# EasyEDA Pro project ProDoc_PCB3_1_.epro

# Board PCB3_1
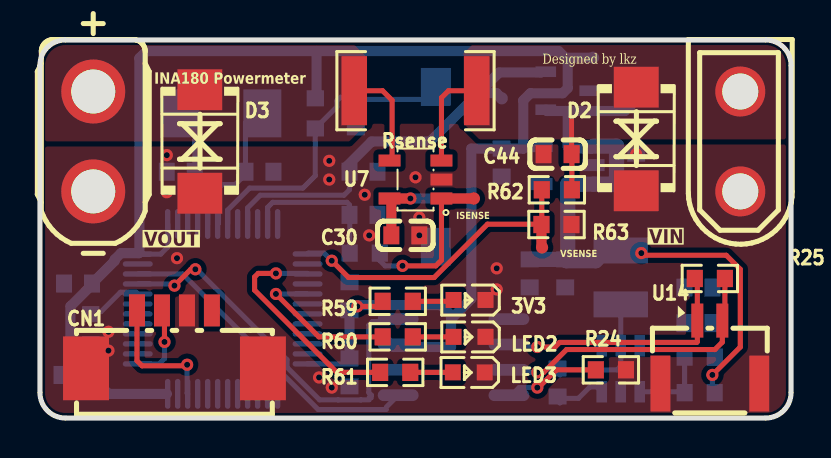
[diagram p0: board, top side]
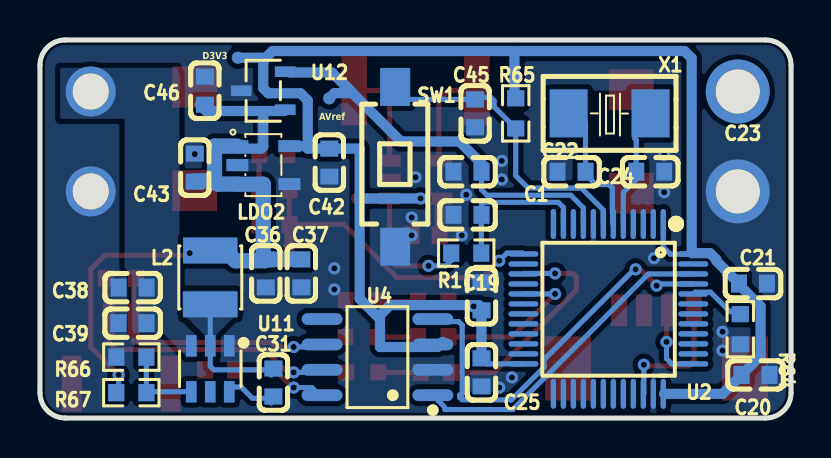
[diagram p1: board, bottom side, seen from below]

Outline 37.59 x 18.92 mm; copper layers: Top Layer, Bottom Layer. Coordinates in mm from the lower left corner of the outline.
Outline path: 0,17.65 0,1.27 arc(0.37,0.37) 1.27,0 36.32,0 arc(37.22,0.37) 37.59,1.27 37.59,17.65 arc(37.22,18.55) 36.32,18.92 1.27,18.92 arc(0.37,18.55) 0,17.65
Stack: Top Layer 0.035mm / Dielectric1 1.51mm FR4 er 4.5 / Bottom Layer 0.035mm

## Design rules (mm)
template: 自定义配置
spacing copperThickness1oz (default): track to track 0.102, other pairs 0.152 to 0.3
spacing copperThickness2oz: track to track 0.203, other pairs 0.152 to 0.3
track width copperThickness1oz (default): min 0.127, default 0.254, max 2.54
track width copperThickness2oz: min 0.203, default 0.254, max 2.54
differential pair differentialPair (default): width min 0.127, default 0.254, max 2.54; gap min 0.152, default 0.152
via viaSize (default): diameter min 0.5, default 0.61, max 10; hole min 0.3, default 0.305, max 6.3
net GND uses copperRegion1
net $3N7199 uses copperRegion1
net +5V uses copperRegion1
net VIN uses copperRegion1
net VOUT uses copperRegion1

## Placement (name value [footprint] x y rotation side)
3V3  KT-0603R  [LED0603-RD]  21.5 5.91 180 top
C1  100nF  [C0603]  16.19 10.17 180 bottom
C19  100nF  [C0603]  15.49 6.1 270 bottom
C20  100nF  [C0603]  1.78 2.16 0 bottom
C21  100nF  [C0603]  1.91 6.73 0 bottom
C22  100nF  [C0603]  16.19 12.33 180 bottom
C23  20pF  [C0603]  7.05 12.33 0 bottom
C24  20pF  [C0603]  10.99 12.33 180 bottom
C25  100nF  [C0603]  15.49 2.29 90 bottom
C30  100nF  [C0603]  18.29 9.14 180 top
C31  100nF  [C0603]  25.91 1.78 270 bottom
C36  1uF  [C0603]  26.29 7.24 90 bottom
C37  100nF  [C0603]  24.51 7.24 90 bottom
C38  1uF  [C0603]  32.95 6.53 180 bottom
C39  100nF  [C0603]  32.95 4.75 180 bottom
C42  1uF  [C0603]  23.11 12.79 90 bottom
C43  1uF  [C0603]  29.84 12.53 90 bottom
C44  100nF  [C0603]  25.91 13.21 0 top
C45  100nF  [C0603]  15.81 15.25 270 bottom
C46  470nF  [C0603]  29.34 16.38 270 bottom
CN1  532610471  [CONN-SMD_4P-P1.25_53261-0471]  6.73 3.94 0 top
D2  SMBJ28CA  [SMB_L4.6-W3.6-LS5.3-BI]  29.84 13.97 90 top
D3  SMBJ28CA  [SMB_L4.6-W3.6-LS5.3-BI]  8 13.84 90 top
L2  22uH  [IND-SMD_L3.0-W3.0_FNR30XXS]  29.07 7.04 270 bottom
LDO2  TPS70933DBVR  [SOT-23-5_L3.0-W1.7-P0.95-LS2.8-BR]  26.41 12.66 0 bottom
LED2  KT-0603R  [LED0603-RD]  21.5 4.06 180 top
LED3  KT-0603R  [LED0603-RD]  21.46 2.29 180 top
NOREF  -  [Pad_e407]  21.72 10.99 0 top
NOREF#2  -  [Pad_e404]  25.13 8.54 0 top
NOREF#3  -  [Pad_e456]  27.69 18.03 0 top
NOREF#4  -  [Pad_e418]  23.11 16 0 top
R1  50Ω  [R0603]  16.26 8.26 0 bottom
R24  10K  [R0603]  28.57 2.41 180 top
R25  120Ω  [R0603]  33.53 6.98 0 top
R59  680Ω  [R0603]  17.91 5.84 0 top
R60  680Ω  [R0603]  17.91 4.06 0 top
R61  680Ω  [R0603]  17.78 2.29 0 top
R62  1kΩ  [R0603]  25.87 11.43 0 top
R63  100Ω  [R0603]  25.85 9.69 180 top
R64  10kΩ  [R0603]  2.54 4.45 270 bottom
R65  10kΩ  [R0603]  13.78 15.25 270 bottom
R66  4.7kΩ  [R0603]  33.02 3.05 180 bottom
R67  33kΩ  [R0603]  33.02 1.27 0 bottom
Rsense  5mΩ  [R2512]  18.8 16.38 180 top
SW1  TS-1101-C-W  [SW-SMD_L6.0-W3.3-LS8.0]  19.81 12.57 270 bottom
U2  STM32F103C8T6  [LQFP-48_L7.0-W7.0-P0.50-LS9.0-BL]  9.14 5.46 0 bottom
U4  SN65HVD230DR  [SOIC-8_L4.9-W3.9-P1.27-LS6.0-BL]  20.7 3.05 90 bottom
U7  INA180A1IDBVR  [SOT-23-5_L3.0-W1.7-P0.95-LS2.8-BR]  18.8 11.94 0 top
U11  TPS54302DDCR  [SOT-23-6_L2.9-W1.6-P0.95-LS2.8-BL]  29.07 2.47 0 bottom
U12  REF3033AIDBZR  [SOT-23-3_L3.0-W1.7-P0.95-LS2.9-BR]  26.42 16.38 180 bottom
U14  -  [CONN-SMD_2P-P1.25_BX-GH1.25-2PWT]  33.53 3.3 0 top
VIN  XT30UPB-M  [CONN-TH_XT30UPB-M]  35.05 13.84 90 top
VOUT  XT30UPB-F30.G.Y  [CONN-TH_XT30UPB-F]  2.67 13.84 270 top
X1  8MHz  [CRYSTAL-SMD_L5.0-W3.2]  9.08 15.25 180 bottom

## Footprints (pads in the part's own frame, mm; a bottom-side part is the same pattern mirrored in y, then rotated)
C0603
  rect 0.8x0.9 smd: 1(-0.7,0) 2(0.7,0)
CONN-SMD_2P-P1.25_BX-GH1.25-2PWT
  rect 0.6x1.7 smd: 1(-0.625,1.575) 2(0.625,1.575)
  rect 1x2.8 smd: 3(2.475,-1.575) 4(-2.475,-1.575)
CONN-SMD_4P-P1.25_53261-0471
  rect 0.8x1.6 smd: 1(-1.875,1.45) 2(-0.625,1.45) 3(0.625,1.45) 4(1.875,1.45)
  rect 2.3x3.2 smd: 5(4.425,-1.45) 6(-4.425,-1.45)
CONN-TH_XT30UPB-F
  round 3.2 hole 2.2: 1(-2.5,0) 2(2.5,0)
CONN-TH_XT30UPB-M
  round 2.5 hole 1.8: 1(-2.5,0) 2(2.5,0)
CRYSTAL-SMD_L5.0-W3.2
  rect 1.9x2.4 smd: 1(-2.05,0) 2(2.05,0)
IND-SMD_L3.0-W3.0_FNR30XXS
  rect 1.3x2.72 smd: 1(1.35,0) 2(-1.35,0)
LED0603-RD
  rect 0.8x0.8 smd: 1(-0.799,0) 2(0.799,0)
LQFP-48_L7.0-W7.0-P0.50-LS9.0-BL
  oval 0.27x1.5 smd: 1(-2.75,-4.25) 2(-2.25,-4.25) 3(-1.75,-4.25) 4(-1.25,-4.25) 5(-0.75,-4.25) 6(-0.25,-4.25) 7(0.25,-4.25) 8(0.75,-4.25) 9(1.25,-4.25) 10(1.75,-4.25) 11(2.25,-4.25) 12(2.75,-4.25) 25(2.75,4.25) 26(2.25,4.25) 27(1.75,4.25) 28(1.25,4.25) 29(0.75,4.25) 30(0.25,4.25) 31(-0.25,4.25) 32(-0.75,4.25) 33(-1.25,4.25) 34(-1.75,4.25) 35(-2.25,4.25) 36(-2.75,4.25)
  oval 1.5x0.27 smd: 13(4.25,-2.75) 14(4.25,-2.25) 15(4.25,-1.75) 16(4.25,-1.25) 17(4.25,-0.75) 18(4.25,-0.25) 19(4.25,0.25) 20(4.25,0.75) 21(4.25,1.25) 22(4.25,1.75) 23(4.25,2.25) 24(4.25,2.75) 37(-4.25,2.75) 38(-4.25,2.25) 39(-4.25,1.75) 40(-4.25,1.25) 41(-4.25,0.75) 42(-4.25,0.25) 43(-4.25,-0.25) 44(-4.25,-0.75) 45(-4.25,-1.25) 46(-4.25,-1.75) 47(-4.25,-2.25) 48(-4.25,-2.75)
Pad_e404
  round 0.61 smd: TP2(0,0)
Pad_e407
  round 0.61 smd: TP3(0,0)
Pad_e418
  round 0.61 smd far side: TP4(0,0)
Pad_e456
  round 0.61 smd far side: TP5(0,0)
R0603
  rect 0.806x0.864 smd: 1(-0.753,0) 2(0.753,0)
R2512
  rect 1.282x3.456 smd: 1(-3.067,0) 2(3.067,0)
SMB_L4.6-W3.6-LS5.3-BI
  rect 2.047x2.241 smd: 1(-2.591,0) 2(2.591,0)
SOIC-8_L4.9-W3.9-P1.27-LS6.0-BL
  oval 0.588x2.045 smd: 1(-1.905,-2.772) 2(-0.635,-2.772) 3(0.635,-2.772) 4(1.905,-2.772) 5(1.905,2.772) 6(0.635,2.772) 7(-0.635,2.772) 8(-1.905,2.772)
SOT-23-3_L3.0-W1.7-P0.95-LS2.9-BR
  rect 1.038x0.532 smd: 1(1.101,-0.95) 2(1.101,0.95) 3(-1.101,0)
SOT-23-5_L3.0-W1.7-P0.95-LS2.8-BR
  rect 1.1x0.6 smd: 1(1.3,-0.95) 2(1.3,0) 3(1.3,0.95) 4(-1.3,0.95) 5(-1.3,-0.95)
SOT-23-6_L2.9-W1.6-P0.95-LS2.8-BL
  rect 0.532x1.072 smd: 1(-0.95,-1.149) 2(0,-1.149) 3(0.95,-1.149) 4(0.95,1.149) 5(0,1.149) 6(-0.95,1.149)
SW-SMD_L6.0-W3.3-LS8.0
  rect 1.9x1.5 smd: 1(-4,0) 2(4,0)

## Nets
3V3: CN1.4
+5V: C36.2 C37.2 C43.1 C46.2 L2.2 LDO2.1 LDO2.3 R67.2 U12.1
A3V3: C22.2 NOREF#4.TP4 U2.9 U12.2
D3V3: C19.2 C20.2 C21.2 C25.2 C30.2 C42.2 LDO2.5 NOREF#3.TP5 R59.1 R65.1 U2.1 U2.24 U2.36 U2.48 U4.3 U7.5
GND: 3V3.1 C1.1 C19.1 C20.1 C21.1 C22.1 C23.1 C24.1 C25.1 C30.1 C36.1 C37.1 C38.1 C39.1 C42.1 C43.2 C44.1 C45.2 C46.1 CN1.3 CN1.5 CN1.6 D2.1 D3.1 LDO2.2 LDO2.4 LED2.1 LED3.1 R24.1 R63.1 R64.2 R66.1 SW1.2 U2.8 U2.23 U2.35 U2.47 U4.2 U7.2 U11.1 U12.3 U14.3 U14.4 VIN.1 VOUT.2
VIN: C38.2 C39.2 C44.2 D2.2 R62.2 Rsense.1 U7.3 U11.3 VIN.2
CAN_RX: U2.45 U4.4
CAN_TX: U2.46 U4.1
CANH: R25.2 U4.7 U14.2
CANL: R25.1 U4.6 U14.1
ISENSE: C1.2 R1.1 U2.11
LED1: R60.1 U2.17
LED2: R61.1 U2.15
NRST: C45.1 R65.2 SW1.1 U2.7
OSC_IN: C23.2 U2.5 X1.2
OSC_OUT: C24.2 U2.6 X1.1
SWCLK: CN1.2 U2.37
SWDIO: CN1.1 U2.34
VOUT: D3.2 Rsense.2 U7.4 VOUT.1
VSENSE: NOREF#2.TP2 R62.1 R63.2 U2.13
$3N2677: R64.1 U2.44
$3N3524: R24.2 U4.8
$3N5395: NOREF.TP3 R1.2 U7.1
$3N7195: C31.2 U11.6
$3N7199: C31.1 L2.1 U11.2
$3N7282: R66.2 R67.1 U11.4
$3N7699: 3V3.2 R59.2
$3N7872: LED2.2 R60.2
$3N8033: LED3.2 R61.2

Pads without a net: U2 2 3 4 10 12 14 16 18 19 20 21 22 25 26 27 28 29 30 31 32 33 38 39 40 41 42 43; U4 5; U11 5

## Via types
v1: diameter 0.61, hole 0.305, Top Layer to Bottom Layer, 32 vias

## Routing (per net, layer and track width the routed paths; a pad name or vN(x,y) marks a point on that pad's centre or on a via; arc(x,y) is an arc through that point)
+5V: length 35.8
  Top Layer w0.254: v1(33.66,2.16) 35.05,3.56 35.05,7.44 34.35,8.15 30.21,8.15 v1(30.1,8.26)
  Bottom Layer w0.254: v1(33.66,2.16) 33.66,1.39 R67.2 ; L2.2 29.97,8.39 v1(30.1,8.26)
  Bottom Layer w0.508: U12.1 25.38,15.37 26.29,15.37 ; 26.29,15.37 29.28,15.37 29.59,15.68 ; 26.29,15.37 26.42,15.24 26.42,13.59 26.52,13.48 27.58,13.48 LDO2.1
  Bottom Layer w0.762: C36.2 26.42,8.07 26.42,11.7 27.7,11.7 ; C36.2 C37.2 ; C36.2 26.35,7.87 27.81,7.87 28.33,8.39 L2.2 ; 28.86,11.86 28.7,11.71 LDO2.3 ; 28.86,11.86 29.81,11.86 C43.1 ; 28.86,11.86 28.86,13.61 27.71,13.61
A3V3: length 20.4
  Bottom Layer w0.254: U2.9 10.39,10.52 11.03,11.15 15.22,11.15 15.49,11.43 C22.2
  Bottom Layer w0.508: 21.95,16.27 22.85,16.27 NOREF#4.TP4 ; 21.95,16.27 19.53,13.84 16.6,13.84 15.37,12.61 15.37,12.45 C22.2 ; 21.95,16.27 22.13,16.44 22.13,16.46 22.36,16.7 22.39,16.7 22.98,17.3 25.06,17.3 25.06,17.29
D3V3: length 91.8
  Top Layer w0.254: v1(15.88,5.59) 16.9,5.59 R59.1
  Top Layer w0.508: C30.2 17.59,10.9 U7.5 v1(18.54,10.99)
  Bottom Layer w0.254: U2.24 15.22,2.71 C25.2 ; U2.1 6.39,8.55 6.04,8.2 4.9,8.2 U2.48
  Bottom Layer w0.508: 17.44,3.81 17.7,3.56 20.57,3.56 20.57,4.95 ; 17.07,5.65 15.62,5.65 15.49,5.52 C19.2 C25.2 ; v1(18.54,10.99) 21.58,10.99 21.59,10.98 ; 21.59,10.98 21.59,13.49 C42.2 24.19,13.49 ; 21.59,10.98 21.59,5.97 20.57,4.95 ; 2.6,2.29 2.6,2.16 ; 13.84,18.37 13.84,16.07 R65.1 ; 13.84,18.37 5.33,18.37 4.97,18.01 4.97,8.28 4.95,8.25 4.06,8.25 3.74,7.94 3.74,7.86 2.6,6.73 2.6,6.67 1.52,5.59 1.52,3.11 1.62,3.02 1.65,3.02 1.88,2.78 1.88,2.75 C20.2 ; 13.84,18.37 25.95,18.37 26.29,18.03 ; 24.19,13.49 24.31,13.61 LDO2.5 ; 24.19,13.49 24.19,15.9 24.55,16.26 26.16,16.26 26.42,16.51 26.42,17.91 26.29,18.03 ; 26.29,18.03 NOREF#3.TP5 ; 20.57,4.95 20.57,5.15 20.07,5.65 17.13,5.65 ; 6.35,1.21 3.43,1.21 2.6,2.03
GND:
  vias: v1(3.43,4.32) v1(3.43,3.38) v1(6.35,13.16) v1(6.35,11.3) v1(6.86,8) v1(13.97,2.03) v1(14.48,12.87) v1(14.48,11.94) v1(14.6,1.52) v1(16.26,11.18) v1(16.48,9.14) v1(18.8,12.05) v1(18.99,10.04) v1(18.99,9.14) v1(22.86,7.49) v1(22.86,6.44) v1(29.84,13.21)
VIN: length 8.7
  Top Layer w0.254: 26.61,14.99 C44.2 26.62,13.19 R62.2 ; Rsense.1 20.45,16.38 20.1,16.03 20.1,13.02 20.22,12.89
CAN_RX: length 20.3
  Top Layer w0.254: v1(6.73,6.63) 7.55,7.44 v1(7.78,7.44)
  Bottom Layer w0.254: 16.58,1.14 16.46,1.27 16.46,4.65 16.64,4.83 17.93,4.83 ; 16.58,1.14 16.58,1.02 ; 16.58,1.14 16.48,1.04 ; U2.45 6.65,6.71 v1(6.73,6.63) ; 16.48,0.91 16.06,0.91 16.06,0.91 14.93,0.91 14.93,0.91 13.99,0.91 12.36,2.54 12.36,2.92 7.84,7.44 v1(7.78,7.44)
CAN_TX: length 16.1
  Bottom Layer w0.254: U2.46 7.14,7.21 13.92,0.43 17.34,0.43 ; 17.34,0.55 U4.1
CANH: length 14.5
  Top Layer w0.254: v1(24.89,2.29) 25.21,2.29 26.36,3.43 33.78,3.43 34.15,3.8 U14.2 34.28,5.01 R25.2
  Bottom Layer w0.254: 23.47,2.29 v1(24.89,2.29)
CANL: length 12.8
  Top Layer w0.254: R25.1 32.9,6.86 U14.1 32.9,3.82 32.87,3.79 26.01,3.79 25.78,3.56 v1(24.89,3.56)
  Bottom Layer w0.254: 23.47,3.56 v1(24.89,3.56)
ISENSE: length 7.5
  Bottom Layer w0.254: U2.11 11.39,10.54 11.65,10.8 15.37,10.8 15.49,10.67 C1.2 15.5,10.16 R1.1
LED1: length 7.8
  Top Layer w0.254: v1(11.81,6.21) 13.96,4.06 R60.1
  Bottom Layer w0.254: U2.17 v1(11.81,6.21)
LED2: length 11.4
  Top Layer w0.254: R61.1 14.86,2.29 10.74,6.4 10.74,7.06 10.92,7.24 v1(11.81,7.24)
  Bottom Layer w0.254: v1(11.81,7.24) 13.37,7.24 U2.15
NRST: length 15.3
  Bottom Layer w0.254: U2.7 9.39,10.41 10.49,11.51 13.16,11.51 13.78,12.13 R65.2 14.86,15.57 14.86,15.88 15.04,16.05 15.71,16.05 C45.1 19.19,15.95 SW1.1
OSC_IN: length 6.5
  Bottom Layer w0.254: U2.5 8.39,11.29 7.75,11.94 C23.2 7.75,13.92 7.81,13.98 7.81,14.23 7.03,15.01 7.03,15.63
OSC_OUT: length 7.2
  Bottom Layer w0.254: 11.13,15.63 10.29,14.78 C24.2 10.29,12.2 9.77,11.68 9.11,11.68 8.94,11.5 8.94,9.75 U2.6
SWCLK: length 3.9
  Top Layer w0.254: v1(6.23,3.81) 6.23,5.26 CN1.2
  Bottom Layer w0.254: U2.37 5.97,2.71 6.23,2.97 v1(6.23,3.81)
SWDIO: length 6.6
  Top Layer w0.254: CN1.1 4.86,2.87 5.11,2.61 7.31,2.61 v1(7.37,2.67)
  Bottom Layer w0.254: U2.34 7.37,1.24 v1(7.37,2.67)
VOUT: length 5.1
  Top Layer w0.254: Rsense.2 17.14,16.38 17.62,15.91 17.62,12.89
VSENSE: length 16.1
  Top Layer w0.254: R63.2 25.12,9.7 ; 25.12,9.7 R62.1 ; 25.12,9.7 22.4,9.7 19.73,7.03 15.45,7.03 v1(14.6,7.87)
  Top Layer w0.508: R63.2 25.1,8.64
  Bottom Layer w0.254: U2.13 13.44,8.26 14.22,8.26 v1(14.6,7.87)
$3N2677: length 2.9
  Bottom Layer w0.254: U2.44 4.81,6.3 4.03,6.3 3.06,5.33 2.41,5.33
$3N3524: length 5
  Top Layer w0.254: 27.82,2.67 27.57,2.41 25.84,2.41 24.96,1.52 v1(24.89,1.52)
  Bottom Layer w0.254: v1(24.89,1.52) 23.98,1.52 23.47,1.02
$3N5395: length 8.4
  Top Layer w0.254: U7.1 20.1,7.9 19.81,7.62 v1(18.15,7.62)
  Top Layer w0.508: U7.1 NOREF.TP3
  Bottom Layer w0.254: R1.2 17.01,7.88 17.27,7.62 v1(18.15,7.62)
$3N7195: length 2.5
  Bottom Layer w0.254: 26.02,0.75 26.26,0.99 26.95,0.99 27.52,1.55 27.88,1.55 U11.6
$3N7199: length 6.5
  Bottom Layer w0.254: 29.07,5.81 U11.2 29.07,2.59 28.89,2.41 26.28,2.41 26.02,2.15
$3N7282: length 4
  Bottom Layer w0.254: U11.4 32.22,1.32 R67.1 R66.2
$3N7699: length 2.1
  Top Layer w0.254: R59.2 20.63,5.84 3V3.2
$3N7872: length 2
  Top Layer w0.254: R60.2 20.7,4.06
$3N8033: length 2
  Top Layer w0.254: R61.2 20.54,2.29

## Copper pours and planes (outline as drawn; the poured copper is in the pictures)
GND on Top Layer: 0,18.86 37.59,18.86 37.59,0 0,0
GND on Bottom Layer: 0,18.92 37.59,18.92 37.59,0 0,0
VIN on Top Layer: 37.5,13.95 37.5,18.89 37.34,19.05 21.99,19.05 21.17,18.23 21.17,14.77 21.99,13.95
VIN on Bottom Layer: 29.72,3.05 29.72,4.06 30.61,4.95 30.61,17.21 30.73,17.53 36.58,17.53 36.58,14.97 33.36,14.97 33.36,7.52 32.96,7.12 32.96,4.24 31.42,4.24 30.23,3.05
VOUT on Top Layer: -0.03,18.94 -0.03,14 0.13,13.84 15.48,13.84 16.29,14.66 16.29,18.12 15.47,18.94
$3N7199 on Bottom Layer: 29.32,3.1 29.32,4.12 30.46,5.26 30.46,6.38 27.77,6.38 27.67,6.28 27.67,5.26 28.81,4.12 28.81,3.08 28.84,3.1

## Text on the board
Bottom Silkscreen Layer: AVref | D3V3
Top Silkscreen Layer: ISENSE | VSENSE | INA180 Powermeter | Designed by lkz
